# Altium project Esima_E_Meter_CPU.PrjPCB
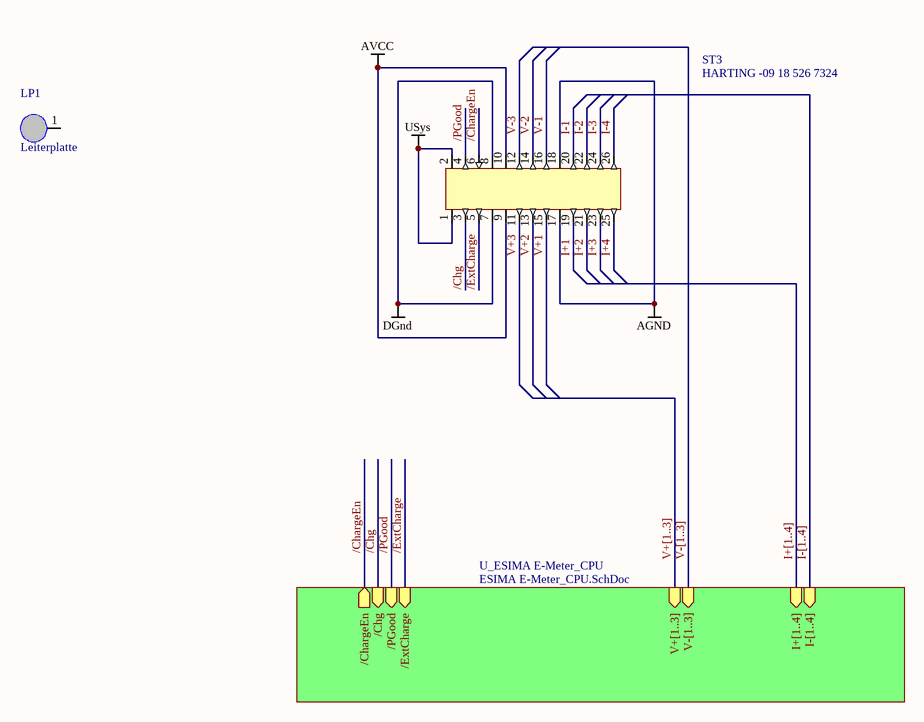
[diagram p0: ESIMA E-Meter_CPUBlock.SchDoc]
5 sheets, 165 parts. Net scope: hierarchical (ports join the sheet entries above them; power ports are global).
Board file: ESIMA_E_Meter_CPU.PcbDoc
Sheets:
  ESIMA E-Meter_CPUBlock.SchDoc
    U_ESIMA E-Meter_CPU = ESIMA E-Meter_CPU.SchDoc
      U_ESIMA E-Meter_RS232 = ESIMA E-Meter_RS232.SchDoc
      U_ESIMA E-Meter_LCD = ESIMA E-Meter_LCD.SchDoc
      U_ESIMA E-Meter_Radio = ESIMA E-Meter_Radio.SchDoc

## Sheet ESIMA E-Meter_CPUBlock.SchDoc: Esima E-Meter CPU Blockdiagramm
size A4; DrawnBy: Jürgen Merz; Address1: Wilhelm- Schickard- Strasse 10; Address2: 78052 Villingen Schwenningen; Address3: juergen.merz@hsg-imit.de; Address4: Tel. +49 7721 943 138; PhoneNumber: +49 7721 943 138; FaxNumber: +49 7721 943 140

### Parts
LP1  Leiterplatte
ST3  HARTING -09 18 526 7324  [HARTING -09 18 526 7324]

### Sub-sheets
U_ESIMA E-Meter_CPU = ESIMA E-Meter_CPU.SchDoc: V+[1..3] (in), V-[1..3] (in), I+[1..4] (in), I-[1..4] (in), /PGood (in), /Chg (in), /ChargeEn (out), /ExtCharge (in)

### Nets
AGND: ST3.17 ST3.18
AVCC: ST3.9 ST3.10
DGnd: ST3.7 ST3.8
USys: ST3.1 ST3.2
/ChargeEn: ST3.6 ; sheet U_ESIMA E-Meter_CPU//ChargeEn
/Chg: ST3.3 ; sheet U_ESIMA E-Meter_CPU//Chg
/ExtCharge: ST3.5 ; sheet U_ESIMA E-Meter_CPU//ExtCharge
/PGood: ST3.4 ; sheet U_ESIMA E-Meter_CPU//PGood
I+1: ST3.19
I+2: ST3.21
I+3: ST3.23
I+4: ST3.25
I-1: ST3.20
I-2: ST3.22
I-3: ST3.24
I-4: ST3.26
V+1: ST3.15
V+2: ST3.13
V+3: ST3.11
V-1: ST3.16
V-2: ST3.14
V-3: ST3.12

Not connected (* = marked no-connect by the designer): LP1 1

### Buses and harness runs
bus I+[1..4] = sheet U_ESIMA E-Meter_CPU/I+[1..4]
bus I-[1..4] = sheet U_ESIMA E-Meter_CPU/I-[1..4]
bus V+[1..3] = sheet U_ESIMA E-Meter_CPU/V+[1..3]
bus V-[1..3] = sheet U_ESIMA E-Meter_CPU/V-[1..3]

### Notes on the sheet
- Title
- Size:
- Date:
- A4
- Number:
- Time:
- Revision:
- Sheet
- of
- File:

### Library data of the parts
LP1 = Passmarke 1mm: Platzhalter für Leiterplatte PCB-Pool in Stückliste
ST3 = Stecker 26Pol zweireihig universal: Supplier 1: Farnell; Supplier Part Number 1: 1106836

## Sheet ESIMA E-Meter_CPU.SchDoc: Esima CPU
size A3; DrawnBy: Jürgen Merz; Address1: Wilhelm- Schickard- Strasse 10; Address2: 78052 Villingen Schwenningen; Address3: juergen.merz@hsg-imit.de; Address4: Tel. +49 7721 943 138; PhoneNumber: +49 7721 943 138; FaxNumber: +49 7721 943 140
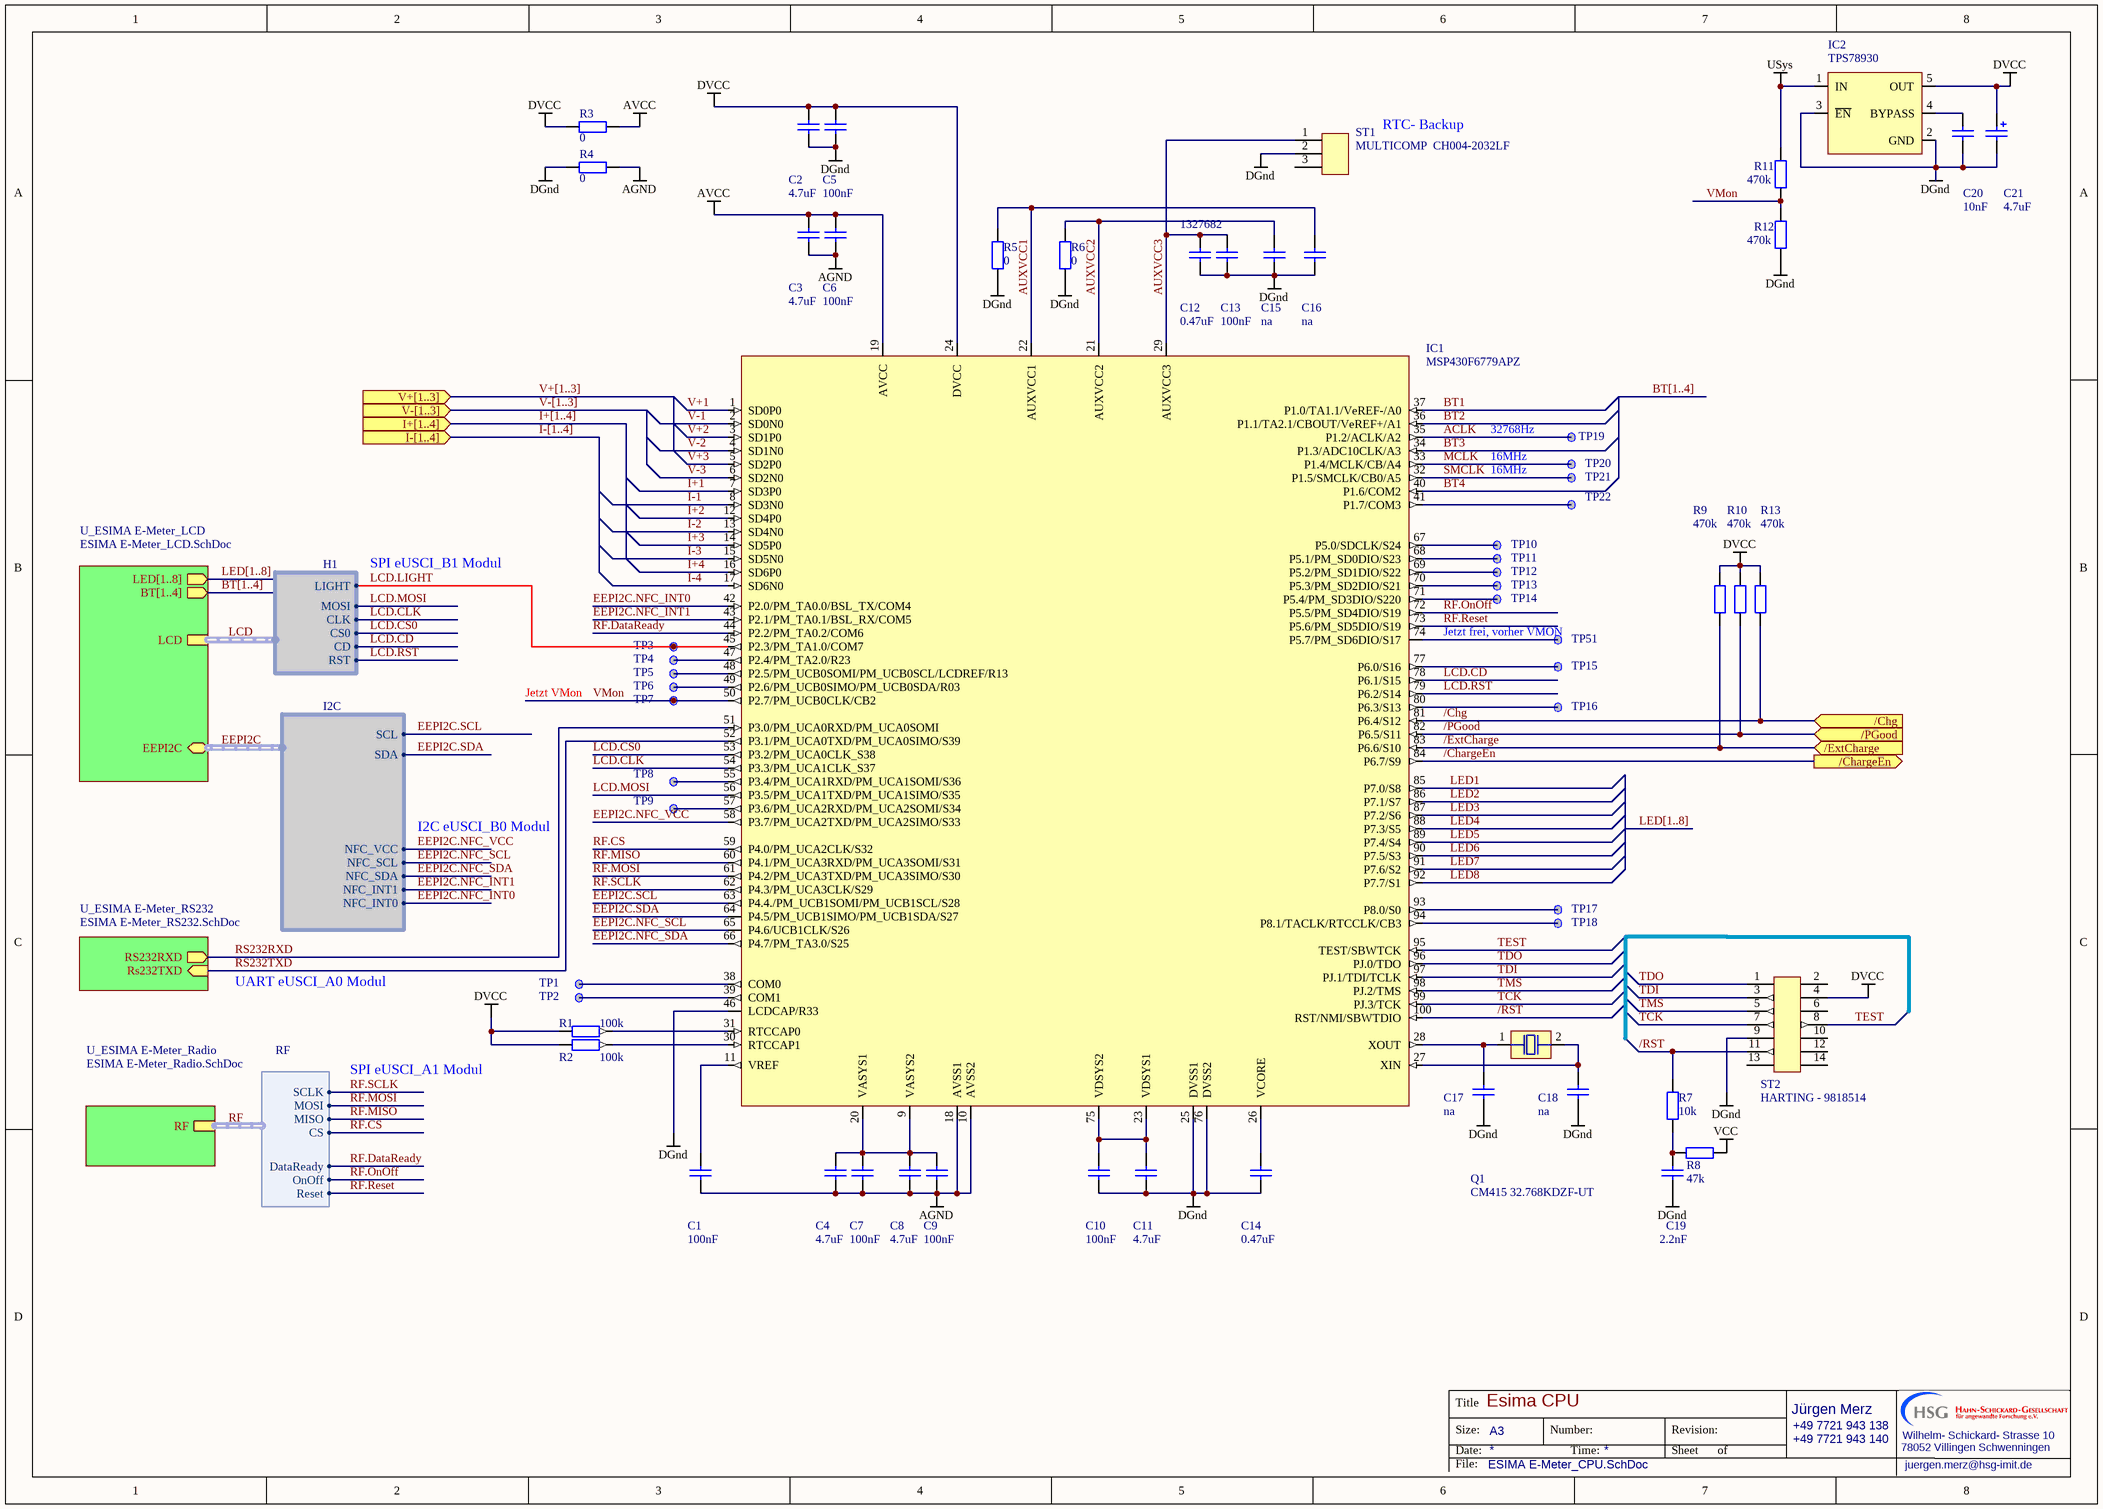
[diagram p1: ESIMA E-Meter_CPU.SchDoc]

### Parts
C1  100nF  [CAPC1608N]
C2  4.7uF  [CAPC1608N]
C3  4.7uF  [CAPC1608N]
C4  4.7uF  [CAPC1608N]
C5  100nF  [CAPC1608N]
C6  100nF  [CAPC1608N]
C7  100nF  [CAPC1608N]
C8  4.7uF  [CAPC1608N]
C9  100nF  [CAPC1608N]
C10  100nF  [CAPC1608N]
C11  4.7uF  [CAPC1608N]
C12  0.47uF  Supplier Part Number 1: 1327682  [CAPC1608N]
C13  100nF  [CAPC1608N]
C14  0.47uF  [CAPC1608N]
C15  na  [CAPC1608N]
C16  na  [CAPC1608N]
C17  na  [CAPC1608N]
C18  na  [CAPC1608N]
C19  2.2nF  [CAPC1608N]
C20  10nF  [CAPC1608N]
C21  4.7uF  [Cap Tant Pol Form B]
IC1  MSP430F6779APZ  [TI-PZ100_N]
IC2  TPS78930  [TI-DBV5 (SOT23-5)]
Q1  CM415 32.768KDZF-UT  [Quarz 2 Pin 4.1mm * 1.5mm]
R1  100k  [RESC1608N]
R2  100k  [RESC1608N]
R3  0  [RESC2012N]
R4  0  [RESC2012N]
R5  0  [RESC1608N]
R6  0  [RESC1608N]
R7  10k  [RESC1608N]
R8  47k  [RESC1608N]
R9  470k  [RESC1608N]
R10  470k  [RESC1608N]
R11  470k  [RESC1608N]
R12  470k  [RESC1608N]
R13  470k  [RESC1608N]
ST1  MULTICOMP  CH004-2032LF  [MULTICOMP  CH004-2032LF]
ST2  HARTING - 9818514  [HARTING -09 18 514 7324]
TP1  Testpoint 1mm  [Testpoint 1mm]  (value not drawn)  (no BOM)
TP2  Testpoint 1mm  [Testpoint 1mm]  (value not drawn)  (no BOM)
TP3  Testpoint 1mm  [Testpoint 1mm]  (value not drawn)  (no BOM)
TP4  Testpoint 1mm  [Testpoint 1mm]  (value not drawn)  (no BOM)
TP5  Testpoint 1mm  [Testpoint 1mm]  (value not drawn)  (no BOM)
TP6  Testpoint 1mm  [Testpoint 1mm]  (value not drawn)  (no BOM)
TP7  Testpoint 1mm  [Testpoint 1mm]  (value not drawn)  (no BOM)
TP8  Testpoint 1mm  [Testpoint 1mm]  (value not drawn)  (no BOM)
TP9  Testpoint 1mm  [Testpoint 1mm]  (value not drawn)  (no BOM)
TP10  Testpoint 1mm  [Testpoint 1mm]  (value not drawn)  (no BOM)
TP11  Testpoint 1mm  [Testpoint 1mm]  (value not drawn)  (no BOM)
TP12  Testpoint 1mm  [Testpoint 1mm]  (value not drawn)  (no BOM)
TP13  Testpoint 1mm  [Testpoint 1mm]  (value not drawn)  (no BOM)
TP14  Testpoint 1mm  [Testpoint 1mm]  (value not drawn)  (no BOM)
TP15  Testpoint 1mm  [Testpoint 1mm]  (value not drawn)  (no BOM)
TP16  Testpoint 1mm  [Testpoint 1mm]  (value not drawn)  (no BOM)
TP17  Testpoint 1mm  [Testpoint 1mm]  (value not drawn)  (no BOM)
TP18  Testpoint 1mm  [Testpoint 1mm]  (value not drawn)  (no BOM)
TP19  Testpoint 1mm  [Testpoint 1mm]  (value not drawn)  (no BOM)
TP20  Testpoint 1mm  [Testpoint 1mm]  (value not drawn)  (no BOM)
TP21  Testpoint 1mm  [Testpoint 1mm]  (value not drawn)  (no BOM)
TP22  Testpoint 1mm  [Testpoint 1mm]  (value not drawn)  (no BOM)
TP51  Testpoint 1mm  [Testpoint 1mm]  (value not drawn)  (no BOM)

### Sub-sheets
U_ESIMA E-Meter_LCD = ESIMA E-Meter_LCD.SchDoc: LED[1..8] (out), BT[1..4] (out, harness H_LCD), LCD (harness H1), EEPI2C (harness I2C)
U_ESIMA E-Meter_Radio = ESIMA E-Meter_Radio.SchDoc: RF (harness RF)
U_ESIMA E-Meter_RS232 = ESIMA E-Meter_RS232.SchDoc: Rs232TXD (in), RS232RXD (out)

### Ports
/ChargeEn (out), /Chg (in), /ExtCharge (in), /PGood (in), I+[1..4] (in), I-[1..4] (in), V+[1..3] (in), V-[1..3] (in)

### Harnesses
RF: SCLK, MOSI, MISO, CS, DataReady, OnOff, Reset
I2C: SCL, SDA, NFC_INT1, NFC_INT0, NFC_VCC, NFC_SCL, NFC_SDA
H1: CS0, MOSI, CLK, CD, RST, LIGHT

### Nets
AGND: C1.1 C3.1 C4.1 C6.1 C7.1 C8.1 C9.1 IC1.10(AVSS2) IC1.18(AVSS1) R4.1
AVCC: C3.2 C6.2 IC1.19(AVCC) R3.1
DGnd: C2.1 C5.1 C10.1 C11.1 C12.1 C13.1 C14.1 C15.1 C16.1 C17.1 C18.1 C19.1 C20.1 C21.2 IC1.25(DVSS1) IC1.46(LCDCAP/R33) IC1.76(DVSS2) IC2.2(GND) IC2.3(~{EN}) R4.2 R5.1 R6.1 R12.1 ST1.2 ST2.9
DVCC: C2.2 C5.2 C21.1 IC1.24(DVCC) IC2.5(OUT) R1.2 R2.2 R3.2 R9.1 R10.1 R13.1 ST2.4
USys: IC2.1(IN) R11.2
VCC: R8.1
/ChargeEn: IC1.84(P6.7/S9) ; port /ChargeEn
/Chg: IC1.81(P6.4/S12) R13.2 ; port /Chg
/ExtCharge: IC1.83(P6.6/S10) R9.2 ; port /ExtCharge
/PGood: IC1.82(P6.5/S11) R10.2 ; port /PGood
/RST: IC1.100(RST/NMI/SBWTDIO) R7.1 ST2.11
ACLK: IC1.35(P1.2/ACLK/A2) TP19.1
AUXVCC1: C16.2 IC1.22(AUXVCC1) R5.2
AUXVCC2: C15.2 IC1.21(AUXVCC2) R6.2
AUXVCC3: C12.2 C13.2 IC1.29(AUXVCC3) ST1.1
BT1: IC1.37(P1.0/TA1.1/VeREF-/A0)
BT2: IC1.36(P1.1/TA2.1/CBOUT/VeREF+/A1)
BT3: IC1.34(P1.3/ADC10CLK/A3)
BT4: IC1.40(P1.6/COM2)
EEPI2C.NFC_INT0: IC1.42(P2.0/PM_TA0.0/BSL_TX/COM4) ; sheet U_ESIMA E-Meter_LCD/EEPI2C.NFC_INT0
EEPI2C.NFC_INT1: IC1.43(P2.1/PM_TA0.1/BSL_RX/COM5) ; sheet U_ESIMA E-Meter_LCD/EEPI2C.NFC_INT1
EEPI2C.NFC_SCL: IC1.65(P4.6/UCB1CLK/S26) ; sheet U_ESIMA E-Meter_LCD/EEPI2C.NFC_SCL
EEPI2C.NFC_SDA: IC1.66(P4.7/PM_TA3.0/S25) ; sheet U_ESIMA E-Meter_LCD/EEPI2C.NFC_SDA
EEPI2C.NFC_VCC: IC1.58(P3.7/PM_UCA2TXD/PM_UCA2SIMO/S33) ; sheet U_ESIMA E-Meter_LCD/EEPI2C.NFC_VCC
EEPI2C.SCL: IC1.63(P4.4./PM_UCB1SOMI/PM_UCB1SCL/S28) ; sheet U_ESIMA E-Meter_LCD/EEPI2C.SCL
EEPI2C.SDA: IC1.64(P4.5/PM_UCB1SIMO/PM_UCB1SDA/S27) ; sheet U_ESIMA E-Meter_LCD/EEPI2C.SDA
I+1: IC1.7(SD3P0)
I+2: IC1.12(SD4P0)
I+3: IC1.14(SD5P0)
I+4: IC1.16(SD6P0)
I-1: IC1.8(SD3N0)
I-2: IC1.13(SD4N0)
I-3: IC1.15(SD5N0)
I-4: IC1.17(SD6N0)
LCD.CD: IC1.78(P6.1/S15) ; sheet U_ESIMA E-Meter_LCD/LCD.CD
LCD.CLK: IC1.54(P3.3/PM_UCA1CLK_S37) ; sheet U_ESIMA E-Meter_LCD/LCD.CLK
LCD.CS0: IC1.53(P3.2/PM_UCA0CLK_S38) ; sheet U_ESIMA E-Meter_LCD/LCD.CS0
LCD.LIGHT: IC1.45(P2.3/PM_TA1.0/COM7) TP3.1 ; sheet U_ESIMA E-Meter_LCD/LCD.LIGHT
LCD.MOSI: IC1.56(P3.5/PM_UCA1TXD/PM_UCA1SIMO/S35) ; sheet U_ESIMA E-Meter_LCD/LCD.MOSI
LCD.RST: IC1.79(P6.2/S14) ; sheet U_ESIMA E-Meter_LCD/LCD.RST
LED1: IC1.85(P7.0/S8)
LED2: IC1.86(P7.1/S7)
LED3: IC1.87(P7.2/S6)
LED4: IC1.88(P7.3/S5)
LED5: IC1.89(P7.4/S4)
LED6: IC1.90(P7.5/S3)
LED7: IC1.91(P7.6/S2)
LED8: IC1.92(P7.7/S1)
MCLK: IC1.33(P1.4/MCLK/CB/A4) TP20.1
RF.CS: IC1.59(P4.0/PM_UCA2CLK/S32) ; sheet U_ESIMA E-Meter_Radio/RF.CS
RF.DataReady: IC1.44(P2.2/PM_TA0.2/COM6) ; sheet U_ESIMA E-Meter_Radio/RF.DataReady
RF.MISO: IC1.60(P4.1/PM_UCA3RXD/PM_UCA3SOMI/S31) ; sheet U_ESIMA E-Meter_Radio/RF.MISO
RF.MOSI: IC1.61(P4.2/PM_UCA3TXD/PM_UCA3SIMO/S30) ; sheet U_ESIMA E-Meter_Radio/RF.MOSI
RF.OnOff: IC1.72(P5.5/PM_SD4DIO/S19) ; sheet U_ESIMA E-Meter_Radio/RF.OnOff
RF.Reset: IC1.73(P5.6/PM_SD5DIO/S19) ; sheet U_ESIMA E-Meter_Radio/RF.Reset
RF.SCLK: IC1.62(P4.3/PM_UCA3CLK/S29) ; sheet U_ESIMA E-Meter_Radio/RF.SCLK
RS232RXD: IC1.51(P3.0/PM_UCA0RXD/PM_UCA0SOMI) ; sheet U_ESIMA E-Meter_RS232/RS232RXD
RS232TXD: IC1.52(P3.1/PM_UCA0TXD/PM_UCA0SIMO/S39) ; sheet U_ESIMA E-Meter_RS232/Rs232TXD
SMCLK: IC1.32(P1.5/SMCLK/CB0/A5) TP21.1
TCK: IC1.99(PJ.3/TCK) ST2.7
TDI: IC1.97(PJ.1/TDI/TCLK) ST2.3
TDO: IC1.96(PJ.0/TDO) ST2.1
TEST: IC1.95(TEST/SBWTCK) ST2.8
TMS: IC1.98(PJ.2/TMS) ST2.5
V+1: IC1.1(SD0P0)
V+2: IC1.3(SD1P0)
V+3: IC1.5(SD2P0)
V-1: IC1.2(SD0N0)
V-2: IC1.4(SD1N0)
V-3: IC1.6(SD2N0)
VMon: IC1.50(P2.7/PM_UCB0CLK/CB2) R11.1 R12.2 TP7.1
NetC1_2: C1.2 IC1.11(VREF)
NetC4_2: C4.2 C7.2 C8.2 C9.2 IC1.9(VASYS2) IC1.20(VASYS1)
NetC10_2: C10.2 C11.2 IC1.23(VDSYS1) IC1.75(VDSYS2)
NetC14_2: C14.2 IC1.26(VCORE)
NetC17_2: C17.2 IC1.28(XOUT) Q1.1(In)
NetC18_2: C18.2 IC1.27(XIN) Q1.2(Out)
NetC19_2: C19.2 R7.2 R8.2
NetC20_2: C20.2 IC2.4(BYPASS)
NetIC1_30: IC1.30(RTCCAP1) R2.1
NetIC1_31: IC1.31(RTCCAP0) R1.1
NetIC1_38: IC1.38(COM0) TP1.1
NetIC1_39: IC1.39(COM1) TP2.1
NetIC1_41: IC1.41(P1.7/COM3) TP22.1
NetIC1_47: IC1.47(P2.4/PM_TA2.0/R23) TP4.1
NetIC1_48: IC1.48(P2.5/PM_UCB0SOMI/PM_UCB0SCL/LCDREF/R13) TP5.1
NetIC1_49: IC1.49(P2.6/PM_UCB0SIMO/PM_UCB0SDA/R03) TP6.1
NetIC1_55: IC1.55(P3.4/PM_UCA1RXD/PM_UCA1SOMI/S36) TP8.1
NetIC1_57: IC1.57(P3.6/PM_UCA2RXD/PM_UCA2SOMI/S34) TP9.1
NetIC1_67: IC1.67(P5.0/SDCLK/S24) TP10.1
NetIC1_68: IC1.68(P5.1/PM_SD0DIO/S23) TP11.1
NetIC1_69: IC1.69(P5.2/PM_SD1DIO/S22) TP12.1
NetIC1_70: IC1.70(P5.3/PM_SD2DIO/S21) TP13.1
NetIC1_71: IC1.71(P5.4/PM_SD3DIO/S220) TP14.1
NetIC1_74: IC1.74(P5.7/PM_SD6DIO/S17) TP51.1
NetIC1_77: IC1.77(P6.0/S16) TP15.1
NetIC1_80: IC1.80(P6.3/S13) TP16.1
NetIC1_93: IC1.93(P8.0/S0) TP17.1
NetIC1_94: IC1.94(P8.1/TACLK/RTCCLK/CB3) TP18.1

Not connected (* = marked no-connect by the designer): ST1 3; ST2 2 6 10 12 13 14

### Buses and harness runs
bus BT[1..4]
bus I+[1..4] = port I+[1..4]
bus I-[1..4] = port I-[1..4]
bus LED[1..8]
bus LED[1..8] = sheet U_ESIMA E-Meter_LCD/LED[1..8]
bus V+[1..3] = port V+[1..3]
bus V-[1..3] = port V-[1..3]
harness EEPI2C = sheet U_ESIMA E-Meter_LCD/EEPI2C
harness LCD = sheet U_ESIMA E-Meter_LCD/LCD
harness RF = sheet U_ESIMA E-Meter_Radio/RF

### Notes on the sheet
- RTC- Backup
- 32768Hz
- 16MHz
- SPI eUSCI_B1 Modul
- (near TP51) Jetzt frei, vorher VMON
- Jetzt VMon
- I2C eUSCI_B0 Modul
- UART eUSCI_A0 Modul
- SPI eUSCI_A1 Modul
- Title
- Size:
- Date:
- A3
- Number:
- Time:
- Revision:
- Sheet
- of
- File:

### Library data of the parts
C1-C20 = CAPC1608 (C0603)
  C1 C5-C7 C9 C10 C13: Supplier 1: Farnell; Supplier Part Number 1: 1657913
  C2-C4 C8 C11: Supplier 1: Farnell; Supplier Part Number 1: 1740638RL
  C12: Supplier 1: Farnell
  C14: Supplier 1: Farnell; Supplier Part Number 1: 1327682
  C19: Supplier 1: Farnell; Supplier Part Number 1: 1657921
  C20: Supplier 1: Farnell; Supplier Part Number 1: 1657919
C21 = Cap Tant Pol Form B: Supplier 1: Farnell; Supplier Part Number 1: 2353051
IC1 = MSP430F6779AIPZ: Mikroprozessor 16bit Polyphase Metering; Supplier 1: Mouser; Supplier Part Number 1: 595-MSP430F6779IPZ
IC2 = TPS78930: Voltageregulator low Current; Supplier 1: Farnell; Supplier Part Number 1: 8461732
Q1 = Quarz 2 Pin 4.1mm * 1.5mm: Supplier 1: Mouser; Supplier Part Number 1: 695-CM41532.768KDZF
R1 R2 R5-R13 = RESC1608 (R0603)
  R1 R2: Supplier 1: Farnell; Supplier Part Number 1: 1576310
  R5 R6: Supplier 1: Farnell; Supplier Part Number 1: 2008343
  R7: Supplier 1: Farnell; Supplier Part Number 1: 2008341
  R8: Supplier 1: Farnell; Supplier Part Number 1: 2333548
  R9 R10 R13: Supplier 1: Farnell; Supplier Part Number 1: 2333613
R3 R4 = RESC2012N (R0805): Supplier 1: Farnell; Supplier Part Number 1: 9333681
ST1 = Stecker 3Pol universal: Supplier 1: Farnell; Supplier Part Number 1: 2064723
ST2 = HARTING - 9818514: Messerleiste Gerade 14Pol; Supplier 1: Farnell; Supplier Part Number 1: 1096986
TP1-TP22 TP51 = Tespoint 1mm

## Sheet ESIMA E-Meter_RS232.SchDoc: Esima RS232
size A3; DrawnBy: Jürgen Merz; Address1: Wilhelm- Schickard- Strasse 10; Address2: 78052 Villingen Schwenningen; Address3: juergen.merz@hsg-imit.de; Address4: Tel. +49 7721 943 138; PhoneNumber: +49 7721 943 138; FaxNumber: +49 7721 943 140
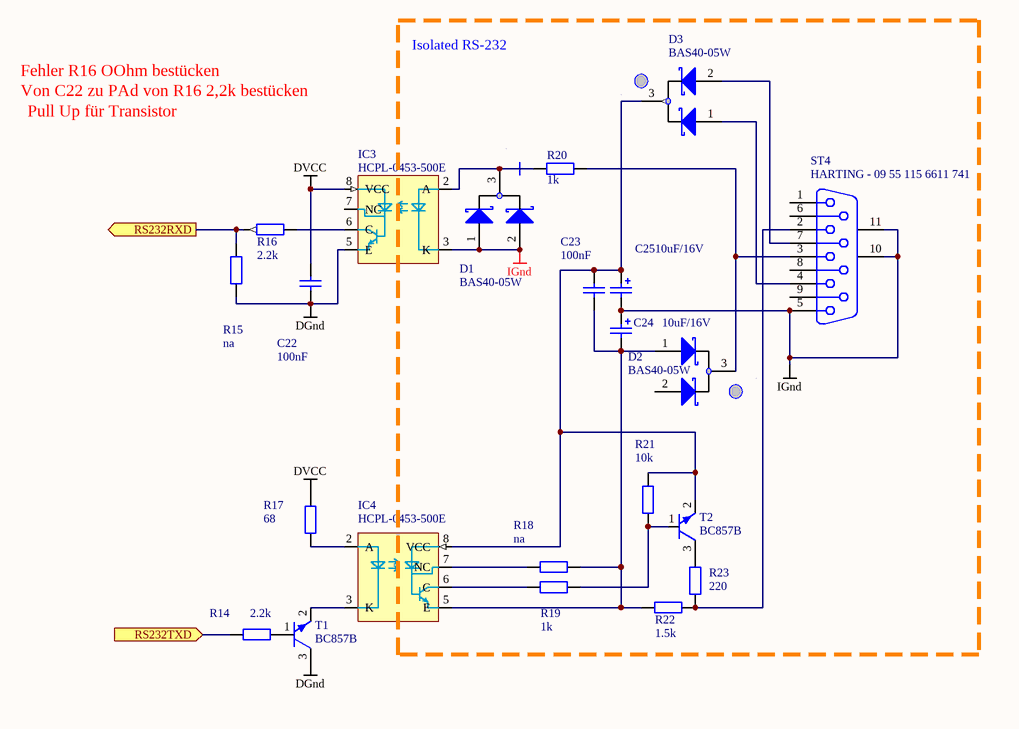
[diagram p2: ESIMA E-Meter_RS232.SchDoc]

### Parts
C22  100nF  [CAPC1608N]
C23  100nF  [CAPC1608N]
C24  10uF/16V  [Cap Tant Pol Form A]
C25  10uF/16V  [Cap Tant Pol Form A]
D1  BAS40-05W  [SOT-323N (SC-70)]
D2  BAS40-05W  [SOT-323N (SC-70)]
D3  BAS40-05W  [SOT-323N (SC-70)]
IC3  HCPL-0453-500E  [SOIC127P600-8N]
IC4  HCPL-0453-500E  [SOIC127P600-8N]
R14  2.2k  [RESC1608N]
R15  na  [RESC1608N]
R16  2.2k  [RESC1608N]
R17  68  [RESC1608N]
R18  na
R19  1k  [RESC1608N]
R20  1k  [RESC1608N]
R21  10k  [RESC1608N]
R22  1.5k  [RESC1608N]
R23  220  [RESC1608N]
ST4  HARTING - 09 55 115 6611 741  [Harting D-SUB SMT 9 poles]
T1  BC857B  [SOT23-3N]
T2  BC857B  [SOT23-3N]

### Blocks framed on the sheet
Isolated RS-232: C23-C25 D1-D3 IC4 R18-R23 ST4 T2

### Ports
RS232RXD (out), RS232TXD (in)

### Nets
DGnd: C22.1 IC3.5(E) R15.2 T1.3(D)
DVCC: C22.2 IC3.8(VCC) R17.1
IGnd: C24.1 C25.2 D1.1(A1) D1.2(A2) IC3.3(K) ST4.5 ST4.10(MH1) ST4.11(MH2)
RS232RXD: R15.1 R16.2 ; port RS232RXD
RS232TXD: R14.2 ; port RS232TXD
NetC23_1: C23.1 C24.2 D2.1(A1) IC4.5(E) R18.1 R22.1
NetC23_2: C23.2 C25.1 D3.3(K) IC4.8(VCC) R21.1 T2.2(S)
NetD1_3: D1.3(K) IC3.2(A) R20.2
NetD2_3: D2.3(K) R20.1 ST4.3
NetD3_1: D3.1(A1) ST4.4
NetD3_2: D3.2(A2) ST4.7
NetIC3_6: IC3.6(C) R16.1
NetIC4_2: IC4.2(A) R17.2
NetIC4_3: IC4.3(K) T1.2(S)
NetIC4_6: IC4.6(C) R19.2
NetIC4_7: IC4.7(NC) R18.2
NetR14_1: R14.1 T1.1(G)
NetR19_1: R19.1 R21.2 T2.1(G)
NetR22_2: R22.2 R23.2 ST4.2
NetR23_1: R23.1 T2.3(D)

Not connected (* = marked no-connect by the designer): D2 2(A2); IC3 1(NC) 4(NC) 7(NC); IC4 1(NC) 4(NC); ST4 1 6 8 9

### Notes on the sheet
- Fehler R16 OOhm bestücken
- Von C22 zu PAd von R16 2,2k bestücken
- Pull Up für Transistor
- Title
- Size:
- Date:
- A3
- Number:
- Time:
- Revision:
- Sheet
- of
- File:

### Library data of the parts
C22 C23 = CAPC1608 (C0603): Supplier 1: Farnell; Supplier Part Number 1: 1657913
C24 C25 = Cap Tant Pol Form A: Supplier 1: Farnell; Supplier Part Number 1: 9227873RL
D1-D3 = BAS40-05W: Diode Schottky Dual SOT-323 (SC70); Supplier 1: Farnell; Supplier Part Number 1: 8734330
IC3 IC4 = PS8802: High Speed Optocoupler SO8; Supplier 1: Mouser; Supplier Part Number 1: 630-HCPL-0453-500E
R14-R23 = RESC1608 (R0603)
  R14 R16: Supplier 1: Farnell; Supplier Part Number 1: 2008338
  R17: Supplier 1: Farnell; Supplier Part Number 2: 2333615
  R18 R19: Supplier 1: Farnell; Supplier Part Number 1: 2008335
  R21: Supplier 1: Farnell; Supplier Part Number 1: 2008341
  R22: Supplier 1: Farnell; Supplier Part Number 1: 2333563
  R23: Supplier 1: Farnell; Supplier Part Number 1: 2333535
ST4 = D Connector 9: HARTING - 09 55 115 6611 741 - D-SUB, BUCHSE, SMT, M3, 9POL; Supplier 1: Farnell; Supplier Part Number 1: 2356655
T1 T2 = Transistor PNP SOT-23: Supplier 1: Farnell; Supplier Part Number 1: 1798069

## Sheet ESIMA E-Meter_LCD.SchDoc: Esima E-Meter LCD- Display
size A3; DrawnBy: Jürgen Merz; Address1: Wilhelm- Schickard- Strasse 10; Address2: 78052 Villingen Schwenningen; Address3: juergen.merz@hsg-imit.de; Address4: Tel. +49 7721 943 138; PhoneNumber: +49 7721 943 138; FaxNumber: +49 7721 943 140
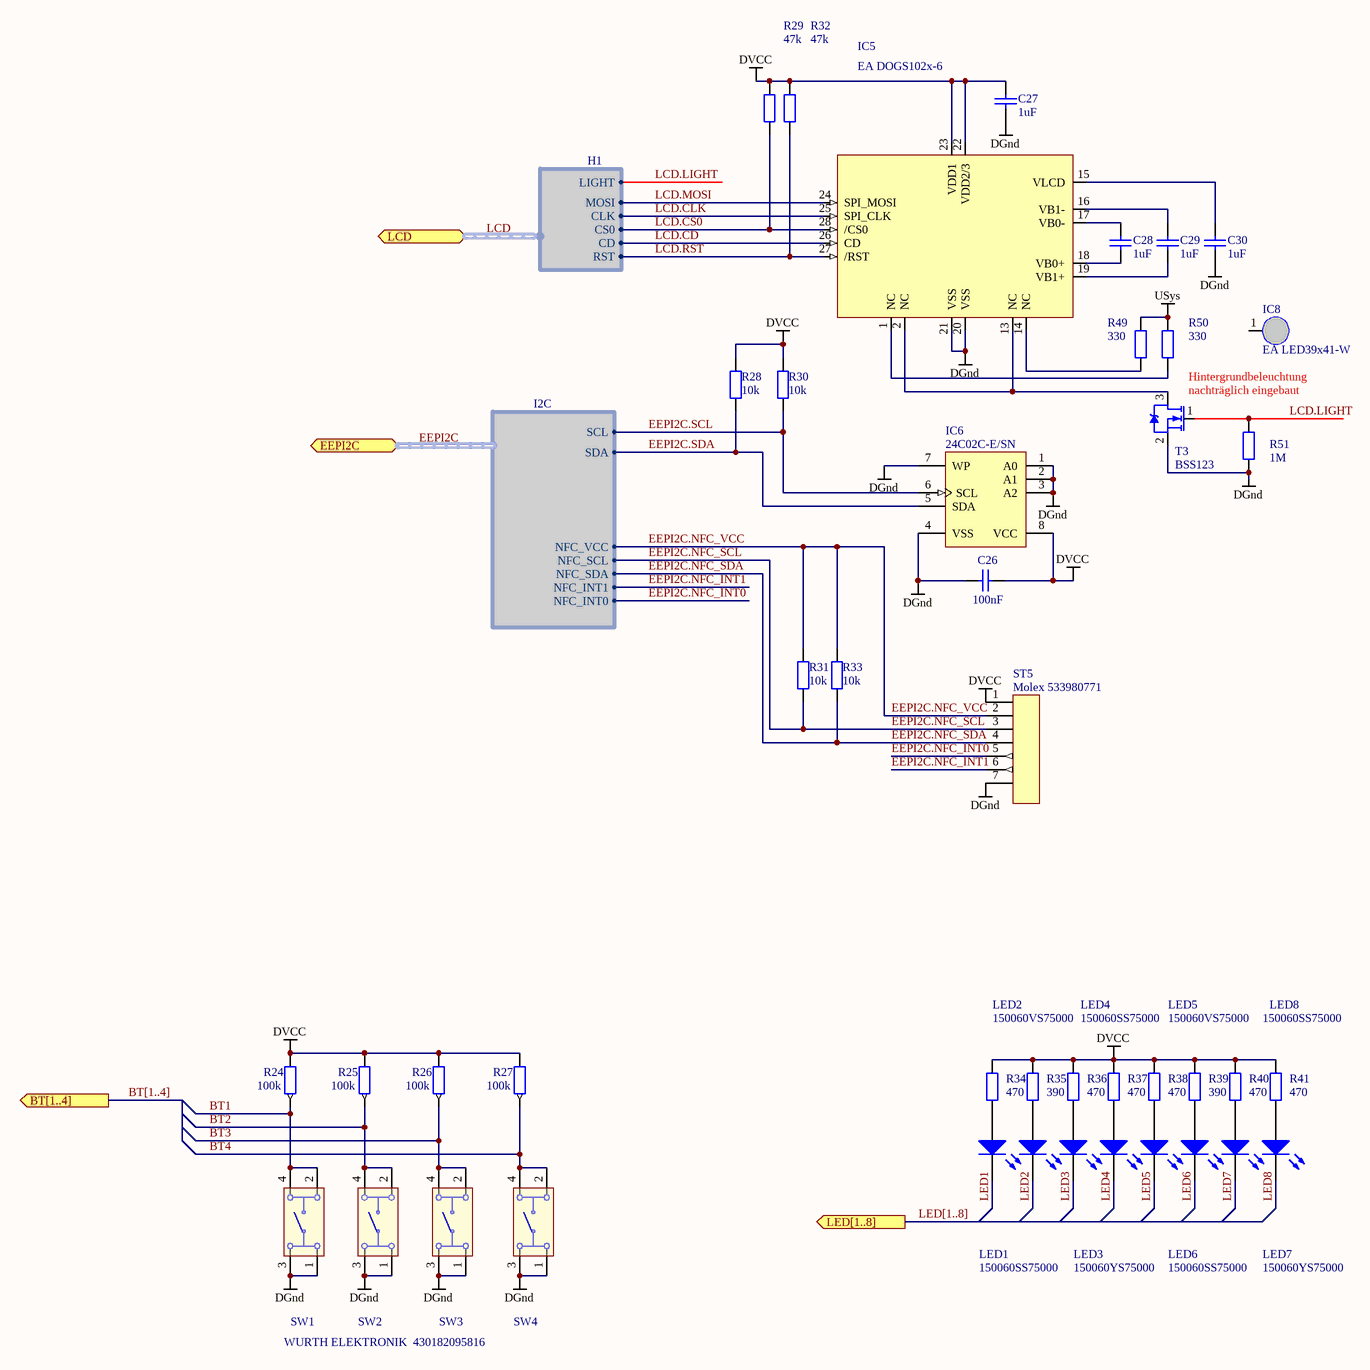
[diagram p3: ESIMA E-Meter_LCD.SchDoc]

### Parts
C26  100nF  [CAPC1608N]
C27  1uF  [CAPC2012N]
C28  1uF  [CAPC2012N]
C29  1uF  [CAPC2012N]
C30  1uF  [CAPC2012N]
IC5  EA DOGS102x-6  [EA DOGS102x-6]
IC6  24C02C-E/SN  [SOIC-SN8_N]
IC8  EA LED39x41-W  (no BOM)
LED1  150060SS75000  [0603]
LED2  150060VS75000  [0603]
LED3  150060YS75000  [0603]
LED4  150060SS75000  [0603]
LED5  150060VS75000  [0603]
LED6  150060SS75000  [0603]
LED7  150060YS75000  [0603]
LED8  150060SS75000  [0603]
R24  100k  [RESC1608N]
R25  100k  [RESC1608N]
R26  100k  [RESC1608N]
R27  100k  [RESC1608N]
R28  10k  [RESC1608N]
R29  47k  [RESC1608N]
R30  10k  [RESC1608N]
R31  10k  [RESC1608N]
R32  47k  [RESC1608N]
R33  10k  [RESC1608N]
R34  470  [RESC1608N]
R35  390  [RESC1608N]
R36  470  [RESC1608N]
R37  470  [RESC1608N]
R38  470  [RESC1608N]
R39  390  [RESC1608N]
R40  470  [RESC1608N]
R41  470  [RESC1608N]
R49  330  [RESC1608N]
R50  330  [RESC1608N]
R51  1M  [RESC1608N]
ST5  Molex 533980771  [Molex 533980771]
SW1  WURTH ELEKTRONIK  430182095816  [430152130826]
SW2  WURTH ELEKTRONIK  430182095816  [430152130826]  (value not drawn)
SW3  WURTH ELEKTRONIK  430182095816  [430152130826]  (value not drawn)
SW4  WURTH ELEKTRONIK  430182095816  [430152130826]  (value not drawn)
T3  BSS123  [SOT23-3N]

### Ports
BT[1..4] (out), EEPI2C (harness I2C), LCD (harness H1), LED[1..8] (out)

### Harnesses
H1: CS0, MOSI, CLK, CD, RST, LIGHT
I2C: SCL, SDA, NFC_INT1, NFC_INT0, NFC_VCC, NFC_SCL, NFC_SDA

### Nets
DGnd: C26.1 C27.1 C30.1 IC5.20(VSS) IC5.21(VSS) IC6.1(A0) IC6.2(A1) IC6.3(A2) IC6.4(VSS) IC6.7(WP) R51.2 ST5.7 SW1.1 SW1.3 SW2.1 SW2.3 SW3.1 SW3.3 SW4.1 SW4.3 T3.2(S)
DVCC: C26.2 C27.2 IC5.22(VDD2/3) IC5.23(VDD1) IC6.8(VCC) R24.2 R25.2 R26.2 R27.2 R28.2 R29.1 R30.2 R32.1 R34.1 R35.1 R36.1 R37.1 R38.1 R39.1 R40.1 R41.1 ST5.1
USys: R49.1 R50.1
BT1: R24.1 SW1.2 SW1.4
BT2: R25.1 SW2.2 SW2.4
BT3: R26.1 SW3.2 SW3.4
BT4: R27.1 SW4.2 SW4.4
EEPI2C.NFC_INT0: ST5.5 ; port EEPI2C.NFC_INT0
EEPI2C.NFC_INT1: ST5.6 ; port EEPI2C.NFC_INT1
EEPI2C.NFC_SCL: R31.1 ST5.3 ; port EEPI2C.NFC_SCL
EEPI2C.NFC_SDA: R33.1 ST5.4 ; port EEPI2C.NFC_SDA
EEPI2C.NFC_VCC: R31.2 R33.2 ST5.2 ; port EEPI2C.NFC_VCC
EEPI2C.SCL: IC6.6(SCL) R30.1 ; port EEPI2C.SCL
EEPI2C.SDA: IC6.5(SDA) R28.1 ; port EEPI2C.SDA
LCD.CD: IC5.26(CD) ; harness H1.CD
LCD.CLK: IC5.25(SPI_CLK) ; harness H1.CLK
LCD.CS0: IC5.28(/CS0) R29.2 ; harness H1.CS0
LCD.LIGHT: R51.1 T3.1(G) ; harness H1.LIGHT
LCD.MOSI: IC5.24(SPI_MOSI) ; harness H1.MOSI
LCD.RST: IC5.27(/RST) R32.2 ; harness H1.RST
LED1: LED1.1(C)
LED2: LED2.1(C)
LED3: LED3.1(C)
LED4: LED4.1(C)
LED5: LED6.1(C)
LED6: LED5.1(C)
LED7: LED7.1(C)
LED8: LED8.1(C)
NetC28_1: C28.1 IC5.18(VB0+)
NetC28_2: C28.2 IC5.17(VB0-)
NetC29_1: C29.1 IC5.19(VB1+)
NetC29_2: C29.2 IC5.16(VB1-)
NetC30_2: C30.2 IC5.15(VLCD)
NetIC5_1: IC5.1(NC) R50.2
NetIC5_2: IC5.2(NC) IC5.13(NC) T3.3(D)
NetIC5_14: IC5.14(NC) R49.2
NetLED1_2: LED1.2(A) R34.2
NetLED2_2: LED2.2(A) R35.2
NetLED3_2: LED3.2(A) R36.2
NetLED4_2: LED4.2(A) R37.2
NetLED5_2: LED5.2(A) R39.2
NetLED6_2: LED6.2(A) R38.2
NetLED7_2: LED7.2(A) R40.2
NetLED8_2: LED8.2(A) R41.2

Not connected (* = marked no-connect by the designer): IC8 1; ST5 8 9

### Buses and harness runs
bus BT[1..4] = port BT[1..4]
bus LED[1..8] = port LED[1..8]
harness EEPI2C = port EEPI2C
harness LCD = port LCD

### Notes on the sheet
- Hintergrundbeleuchtung
- (near T3) nachträglich eingebaut
- Title
- Size:
- Date:
- A3
- Number:
- Time:
- Revision:
- Sheet
- of
- File:

### Library data of the parts
C26 = CAPC1608 (C0603): Supplier 1: Farnell; Supplier Part Number 1: 1657913
C27-C30 = CAPC2012 (C0805)
  C27-C29: Supplier 1: Farnell; Supplier Part Number 1: 9227873RL
IC5 = EA DOGS102x-6: LCD Graphic Display 102*64 Dots SPI-Interface; Supplier 1: Mouser; Supplier Part Number 1: 790-EADOGS102W-6
IC6 = 24C02C-E/SN: 2Kbit, 400kHz, 5V, I2C Serial EEPROM, 8-Pin SOIC 150mil, Extended Temperature; Supplier 1: Farnell; Supplier Part Number 1: 1084339
IC8 = Passmarke 1mm: LCD-Hintergrundbeleuchtung, Part von EA DOGS102x-6; Supplier 1: Mouser; Supplier Part Number 1: 790-EALED39X41-W
LED1 LED4 LED8 = WL-SMCW 0603  150060SS75000: LED, 0603, SUP. ROT, 60MCD, 630NM; Supplier 1: Farnell; Supplier Part Number 1: 2322072
LED2 = WL-SMCW 0603  150060VS75000: LED, 0603, GRÜN, 40MCD, 570NM; Supplier 1: Farnell; Supplier Part Number 1: 2322073
LED3 LED7 = WL-SMCW 0603  150060YS75000: LED, 0603, GELB, 120MCD, 590NM
  LED3: Supplier 1: Farnell; Supplier Part Number 1: 2322074
LED5 = WL-SMCW 0603  150060VS75000: LED, 0603, SUP. ROT, 60MCD, 630NM; Supplier 1: Farnell; Supplier Part Number 1: 2322072
LED6 = WL-SMCW 0603  150060SS75000: LED, 0603, GRÜN, 40MCD, 570NM; Supplier 1: Farnell; Supplier Part Number 1: 2322073
R24-R41 R49-R51 = RESC1608 (R0603)
  R24-R27: Supplier 1: Farnell; Supplier Part Number 1: 1576310
  R28 R30 R31 R33: Supplier 1: Farnell; Supplier Part Number 1: 2008341
  R29 R32 R49-R51: Supplier 1: Farnell; Supplier Part Number 1: 2333548
ST5 = Molex 533980771: Molex Pico 7Pol Blade SMD gerade 533980771; Supplier 1: Farnell; Supplier Part Number 1: 9786368
SW1-SW4 = WE-Tact Switches WS-TASV 430152130826: WS-TASV SMD Tact Switch 6X6 mm; Manufacturer: W¨¹rth Elektronik eiSos GmbH & Co.KG; ComponentLink1 Description: Manufacturer; ComponentLink2 Description: Datasheet; Creat by: Karrer Zheng; NoPins: 04; Creat Date: 28 February 2014; partNo: 430152130826; ComponentLink1URL: http://www.we-online.com; ComponentLink2URL: http://katalog.we-online.de/em/datasheet/4301x2.pdf; Supplier 1: Farnell; Supplier Part Number 1: 2065108
T3 = MOSFET N-Kanal SOT-23: 09_Ersteller: HSG Jürgen Merz; 02_Herstellerbezeichnung: ka; 10_Erstell_Datum: 10.06.2010; Supplier 1: Mouser; Supplier Part Number 1: 512-BSS123L

## Sheet ESIMA E-Meter_Radio.SchDoc: Esima Radio (zu CC2530EVM)
size A3; DrawnBy: Jürgen Merz; Address1: Wilhelm- Schickard- Strasse 10; Address2: 78052 Villingen Schwenningen; Address3: juergen.merz@hsg-imit.de; Address4: Tel. +49 7721 943 138; PhoneNumber: +49 7721 943 138; FaxNumber: +49 7721 943 140
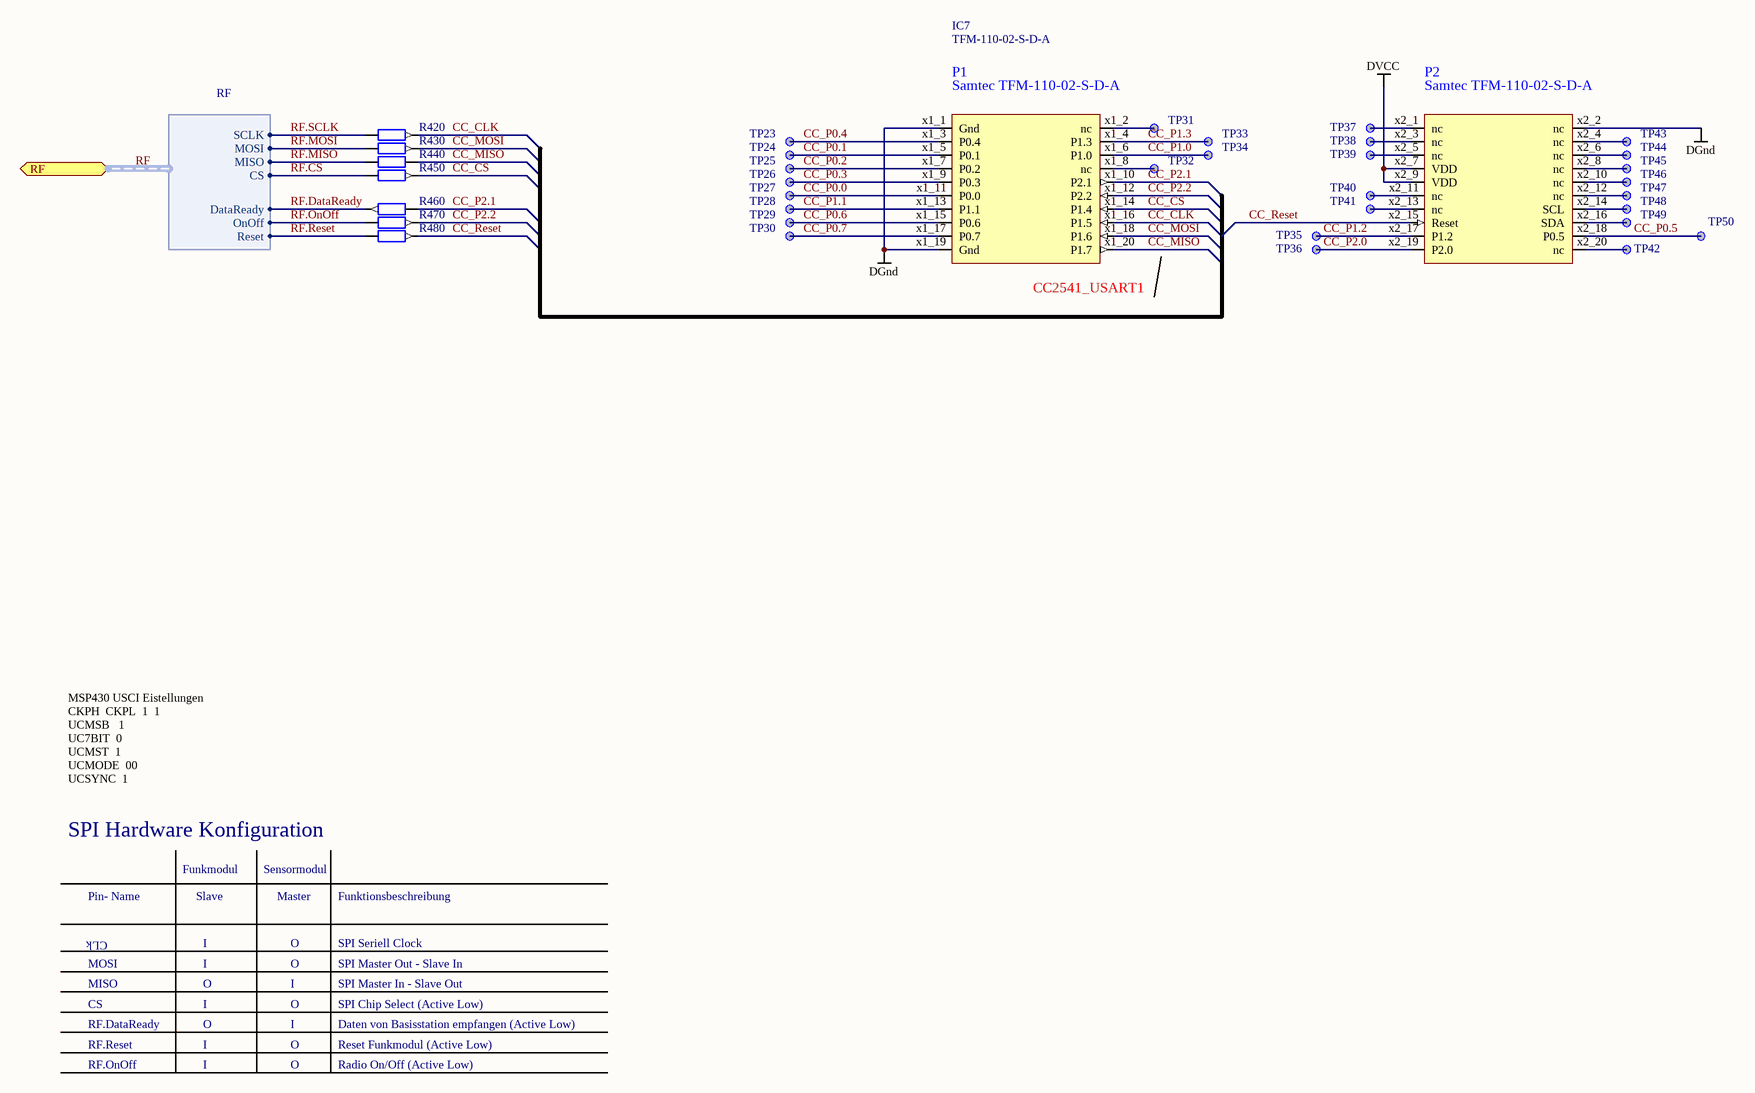
[diagram p4: ESIMA E-Meter_Radio.SchDoc]

### Parts
IC7  TFM-110-02-S-D-A  [CC2530EM-Board]
R42  0  [RESC1608N]
R43  0  [RESC1608N]
R44  0  [RESC1608N]
R45  0  [RESC1608N]
R46  0  [RESC1608N]
R47  0  [RESC1608N]
R48  0  [RESC1608N]
TP23  Testpoint 1mm  [Testpoint 1mm]  (value not drawn)  (no BOM)
TP24  Testpoint 1mm  [Testpoint 1mm]  (value not drawn)  (no BOM)
TP25  Testpoint 1mm  [Testpoint 1mm]  (value not drawn)  (no BOM)
TP26  Testpoint 1mm  [Testpoint 1mm]  (value not drawn)  (no BOM)
TP27  Testpoint 1mm  [Testpoint 1mm]  (value not drawn)  (no BOM)
TP28  Testpoint 1mm  [Testpoint 1mm]  (value not drawn)  (no BOM)
TP29  Testpoint 1mm  [Testpoint 1mm]  (value not drawn)  (no BOM)
TP30  Testpoint 1mm  [Testpoint 1mm]  (value not drawn)  (no BOM)
TP31  Testpoint 1mm  [Testpoint 1mm]  (value not drawn)  (no BOM)
TP32  Testpoint 1mm  [Testpoint 1mm]  (value not drawn)  (no BOM)
TP33  Testpoint 1mm  [Testpoint 1mm]  (value not drawn)  (no BOM)
TP34  Testpoint 1mm  [Testpoint 1mm]  (value not drawn)  (no BOM)
TP35  Testpoint 1mm  [Testpoint 1mm]  (value not drawn)  (no BOM)
TP36  Testpoint 1mm  [Testpoint 1mm]  (value not drawn)  (no BOM)
TP37  Testpoint 1mm  [Testpoint 1mm]  (value not drawn)  (no BOM)
TP38  Testpoint 1mm  [Testpoint 1mm]  (value not drawn)  (no BOM)
TP39  Testpoint 1mm  [Testpoint 1mm]  (value not drawn)  (no BOM)
TP40  Testpoint 1mm  [Testpoint 1mm]  (value not drawn)  (no BOM)
TP41  Testpoint 1mm  [Testpoint 1mm]  (value not drawn)  (no BOM)
TP42  Testpoint 1mm  [Testpoint 1mm]  (value not drawn)  (no BOM)
TP43  Testpoint 1mm  [Testpoint 1mm]  (value not drawn)  (no BOM)
TP44  Testpoint 1mm  [Testpoint 1mm]  (value not drawn)  (no BOM)
TP45  Testpoint 1mm  [Testpoint 1mm]  (value not drawn)  (no BOM)
TP46  Testpoint 1mm  [Testpoint 1mm]  (value not drawn)  (no BOM)
TP47  Testpoint 1mm  [Testpoint 1mm]  (value not drawn)  (no BOM)
TP48  Testpoint 1mm  [Testpoint 1mm]  (value not drawn)  (no BOM)
TP49  Testpoint 1mm  [Testpoint 1mm]  (value not drawn)  (no BOM)
TP50  Testpoint 1mm  [Testpoint 1mm]  (value not drawn)  (no BOM)

### Ports
RF (harness RF)

### Harnesses
RF: SCLK, MOSI, MISO, CS, DataReady, OnOff, Reset

### Nets
DGnd: IC7.x1_1(Gnd) IC7.x1_19(Gnd) IC7.x2_2(nc)
DVCC: IC7.x2_7(VDD) IC7.x2_9(VDD)
CC_CLK: IC7.x1_16(P1.5) R42.1
CC_CS: IC7.x1_14(P1.4) R45.1
CC_MISO: IC7.x1_20(P1.7) R44.1
CC_MOSI: IC7.x1_18(P1.6) R43.1
CC_P0.0: IC7.x1_11(P0.0) TP27.1
CC_P0.1: IC7.x1_5(P0.1) TP24.1
CC_P0.2: IC7.x1_7(P0.2) TP25.1
CC_P0.3: IC7.x1_9(P0.3) TP26.1
CC_P0.4: IC7.x1_3(P0.4) TP23.1
CC_P0.5: IC7.x2_18(P0.5) TP50.1
CC_P0.6: IC7.x1_15(P0.6) TP29.1
CC_P0.7: IC7.x1_17(P0.7) TP30.1
CC_P1.0: IC7.x1_6(P1.0) TP34.1
CC_P1.1: IC7.x1_13(P1.1) TP28.1
CC_P1.2: IC7.x2_17(P1.2) TP35.1
CC_P1.3: IC7.x1_4(P1.3) TP33.1
CC_P2.0: IC7.x2_19(P2.0) TP36.1
CC_P2.1: IC7.x1_10(P2.1) R46.1
CC_P2.2: IC7.x1_12(P2.2) R47.1
CC_Reset: IC7.x2_15(Reset) R48.1
RF.CS: R45.2 ; port RF.CS
RF.DataReady: R46.2 ; port RF.DataReady
RF.MISO: R44.2 ; port RF.MISO
RF.MOSI: R43.2 ; port RF.MOSI
RF.OnOff: R47.2 ; port RF.OnOff
RF.Reset: R48.2 ; port RF.Reset
RF.SCLK: R42.2 ; port RF.SCLK
NetIC7_x1_2: IC7.x1_2(nc) TP31.1
NetIC7_x1_8: IC7.x1_8(nc) TP32.1
NetIC7_x2_1: IC7.x2_1(nc) TP37.1
NetIC7_x2_3: IC7.x2_3(nc) TP38.1
NetIC7_x2_4: IC7.x2_4(nc) TP43.1
NetIC7_x2_5: IC7.x2_5(nc) TP39.1
NetIC7_x2_6: IC7.x2_6(nc) TP44.1
NetIC7_x2_8: IC7.x2_8(nc) TP45.1
NetIC7_x2_10: IC7.x2_10(nc) TP46.1
NetIC7_x2_11: IC7.x2_11(nc) TP40.1
NetIC7_x2_12: IC7.x2_12(nc) TP47.1
NetIC7_x2_13: IC7.x2_13(nc) TP41.1
NetIC7_x2_14: IC7.x2_14(SCL) TP48.1
NetIC7_x2_16: IC7.x2_16(SDA) TP49.1
NetIC7_x2_20: IC7.x2_20(nc) TP42.1

### Buses and harness runs
harness RF = port RF

### Notes on the sheet
- (near IC7) CC2541_USART1
- MSP430 USCI Eistellungen
  CKPH  CKPL 	1  1
  UCMSB 		1
  UC7BIT		0
  UCMST		1
  UCMODE		00
  UCSYNC		1
- SPI Hardware Konfiguration
- Pin- Name
- Funkmodul
- Slave
- Sensormodul
- Master
- Funktionsbeschreibung
- MOSI
- CLk
- I
- O
- SPI Seriell Clock
- SPI Master Out - Slave In
- MISO
- CS
- RF.DataReady
- RF.Reset
- SPI Chip Select (Active Low)
- Reset Funkmodul (Active Low)
- Daten von Basisstation empfangen (Active Low)
- SPI Master In - Slave Out
- RF.OnOff
- Radio On/Off (Active Low)
- Title
- Size:
- Date:
- A3
- Number:
- Time:
- Revision:
- Sheet
- of
- File:
- (in symbol CC2530EM) P1; P2; Samtec TFM-110-02-S-D-A

### Library data of the parts
IC7 = CC2530EM: Samtec Connecotor; Supplier 1: Farnell; Supplier Part Number 1: 2308453
R42-R48 = RESC1608 (R0603): Supplier 1: Farnell; Supplier Part Number 1: 2008343
TP23-TP50 = Tespoint 1mm

## Nets that join several sheets
AGND: ESIMA E-Meter_CPUBlock (ST3.17 ST3.18), ESIMA E-Meter_CPU (10 pins)
AVCC: ESIMA E-Meter_CPUBlock (ST3.9 ST3.10), ESIMA E-Meter_CPU (C3.2 C6.2 IC1.19 R3.1)
DGnd: ESIMA E-Meter_CPUBlock (ST3.7 ST3.8), ESIMA E-Meter_CPU (25 pins), ESIMA E-Meter_RS232 (C22.1 IC3.5 R15.2 T1.3), ESIMA E-Meter_LCD (21 pins), ESIMA E-Meter_Radio (IC7.x1_1 IC7.x1_19 IC7.x2_2)
DVCC: ESIMA E-Meter_CPU (12 pins), ESIMA E-Meter_RS232 (C22.2 IC3.8 R17.1), ESIMA E-Meter_LCD (22 pins), ESIMA E-Meter_Radio (IC7.x2_7 IC7.x2_9)
USys: ESIMA E-Meter_CPUBlock (ST3.1 ST3.2), ESIMA E-Meter_CPU (IC2.1 R11.2), ESIMA E-Meter_LCD (R49.1 R50.1)
/ChargeEn: ESIMA E-Meter_CPUBlock (ST3.6), ESIMA E-Meter_CPU (IC1.84)
/Chg: ESIMA E-Meter_CPUBlock (ST3.3), ESIMA E-Meter_CPU (IC1.81 R13.2)
/ExtCharge: ESIMA E-Meter_CPUBlock (ST3.5), ESIMA E-Meter_CPU (IC1.83 R9.2)
/PGood: ESIMA E-Meter_CPUBlock (ST3.4), ESIMA E-Meter_CPU (IC1.82 R10.2)
EEPI2C.NFC_INT0: ESIMA E-Meter_CPU (IC1.42), ESIMA E-Meter_LCD (ST5.5)
EEPI2C.NFC_INT1: ESIMA E-Meter_CPU (IC1.43), ESIMA E-Meter_LCD (ST5.6)
EEPI2C.NFC_SCL: ESIMA E-Meter_CPU (IC1.65), ESIMA E-Meter_LCD (R31.1 ST5.3)
EEPI2C.NFC_SDA: ESIMA E-Meter_CPU (IC1.66), ESIMA E-Meter_LCD (R33.1 ST5.4)
EEPI2C.NFC_VCC: ESIMA E-Meter_CPU (IC1.58), ESIMA E-Meter_LCD (R31.2 R33.2 ST5.2)
EEPI2C.SCL: ESIMA E-Meter_CPU (IC1.63), ESIMA E-Meter_LCD (IC6.6 R30.1)
EEPI2C.SDA: ESIMA E-Meter_CPU (IC1.64), ESIMA E-Meter_LCD (IC6.5 R28.1)
I+1: ESIMA E-Meter_CPUBlock (ST3.19), ESIMA E-Meter_CPU (IC1.7)
I+2: ESIMA E-Meter_CPUBlock (ST3.21), ESIMA E-Meter_CPU (IC1.12)
I+3: ESIMA E-Meter_CPUBlock (ST3.23), ESIMA E-Meter_CPU (IC1.14)
I+4: ESIMA E-Meter_CPUBlock (ST3.25), ESIMA E-Meter_CPU (IC1.16)
I-1: ESIMA E-Meter_CPUBlock (ST3.20), ESIMA E-Meter_CPU (IC1.8)
I-2: ESIMA E-Meter_CPUBlock (ST3.22), ESIMA E-Meter_CPU (IC1.13)
I-3: ESIMA E-Meter_CPUBlock (ST3.24), ESIMA E-Meter_CPU (IC1.15)
I-4: ESIMA E-Meter_CPUBlock (ST3.26), ESIMA E-Meter_CPU (IC1.17)
LED1: ESIMA E-Meter_CPU (IC1.85), ESIMA E-Meter_LCD (LED1.1)
LED2: ESIMA E-Meter_CPU (IC1.86), ESIMA E-Meter_LCD (LED2.1)
LED3: ESIMA E-Meter_CPU (IC1.87), ESIMA E-Meter_LCD (LED3.1)
LED4: ESIMA E-Meter_CPU (IC1.88), ESIMA E-Meter_LCD (LED4.1)
LED5: ESIMA E-Meter_CPU (IC1.89), ESIMA E-Meter_LCD (LED6.1)
LED6: ESIMA E-Meter_CPU (IC1.90), ESIMA E-Meter_LCD (LED5.1)
LED7: ESIMA E-Meter_CPU (IC1.91), ESIMA E-Meter_LCD (LED7.1)
LED8: ESIMA E-Meter_CPU (IC1.92), ESIMA E-Meter_LCD (LED8.1)
RF.CS: ESIMA E-Meter_CPU (IC1.59), ESIMA E-Meter_Radio (R45.2)
RF.DataReady: ESIMA E-Meter_CPU (IC1.44), ESIMA E-Meter_Radio (R46.2)
RF.MISO: ESIMA E-Meter_CPU (IC1.60), ESIMA E-Meter_Radio (R44.2)
RF.MOSI: ESIMA E-Meter_CPU (IC1.61), ESIMA E-Meter_Radio (R43.2)
RF.OnOff: ESIMA E-Meter_CPU (IC1.72), ESIMA E-Meter_Radio (R47.2)
RF.Reset: ESIMA E-Meter_CPU (IC1.73), ESIMA E-Meter_Radio (R48.2)
RF.SCLK: ESIMA E-Meter_CPU (IC1.62), ESIMA E-Meter_Radio (R42.2)
RS232RXD: ESIMA E-Meter_CPU (IC1.51), ESIMA E-Meter_RS232 (R15.1 R16.2)
RS232TXD: ESIMA E-Meter_CPU (IC1.52), ESIMA E-Meter_RS232 (R14.2)
V+1: ESIMA E-Meter_CPUBlock (ST3.15), ESIMA E-Meter_CPU (IC1.1)
V+2: ESIMA E-Meter_CPUBlock (ST3.13), ESIMA E-Meter_CPU (IC1.3)
V+3: ESIMA E-Meter_CPUBlock (ST3.11), ESIMA E-Meter_CPU (IC1.5)
V-1: ESIMA E-Meter_CPUBlock (ST3.16), ESIMA E-Meter_CPU (IC1.2)
V-2: ESIMA E-Meter_CPUBlock (ST3.14), ESIMA E-Meter_CPU (IC1.4)
V-3: ESIMA E-Meter_CPUBlock (ST3.12), ESIMA E-Meter_CPU (IC1.6)